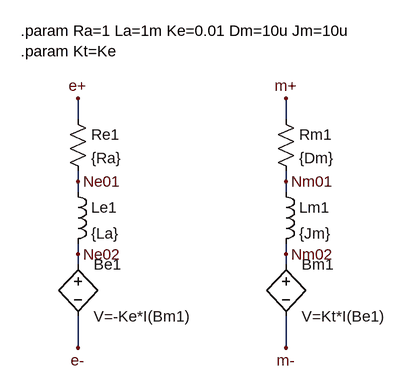
[diagram p0: schematic DCMotorInternalModel.asc]
DCMotorInternalModel.asc, the LTspice schematic file:
Version 4
SHEET 1 1092 680
WIRE 320 -64 320 -96
WIRE 640 -64 640 -96
WIRE 320 32 320 16
WIRE 640 32 640 16
WIRE 320 48 320 32
WIRE 640 48 640 32
WIRE 320 144 320 128
WIRE 640 144 640 128
WIRE 320 160 320 144
WIRE 640 160 640 144
WIRE 320 288 320 240
WIRE 640 288 640 240
FLAG 320 -96 e+
FLAG 320 288 e-
FLAG 640 -96 m+
FLAG 640 288 m-
FLAG 320 32 Ne01
FLAG 320 144 Ne02
FLAG 640 32 Nm01
FLAG 640 144 Nm02
SYMBOL res 304 -80 R0
SYMATTR InstName Re1
SYMATTR Value {Ra}
SYMBOL ind 304 32 R0
SYMATTR InstName Le1
SYMATTR Value {La}
SYMATTR SpiceLine Rser=0
SYMBOL bv 320 144 R0
SYMATTR InstName Be1
SYMATTR Value V=-Ke*I(Bm1)
SYMBOL res 624 -80 R0
SYMATTR InstName Rm1
SYMATTR Value {Dm}
SYMBOL ind 624 32 R0
SYMATTR InstName Lm1
SYMATTR Value {Jm}
SYMATTR SpiceLine Rser=0
SYMBOL bv 640 144 R0
SYMATTR InstName Bm1
SYMATTR Value V=Kt*I(Be1)
TEXT 232 -200 Left 2 !.param Ra=1 La=1m Ke=0.01 Dm=10u Jm=10u\n.param Kt=Ke

The netlist it stands for:
* DCMotorInternalModel.asc
Re1 e+ Ne01 {Ra}
Le1 Ne01 Ne02 {La} Rser=0
Be1 Ne02 e- V=-Ke*I(Bm1)
Rm1 m+ Nm01 {Dm}
Lm1 Nm01 Nm02 {Jm} Rser=0
Bm1 Nm02 m- V=Kt*I(Be1)
.param Ra=1 La=1m Ke=0.01 Dm=10u Jm=10u
.param Kt=Ke
.backanno
.end